# Altium schematic sheet EXP03_02_2104_20212241212.SchDoc
size A4 portrait
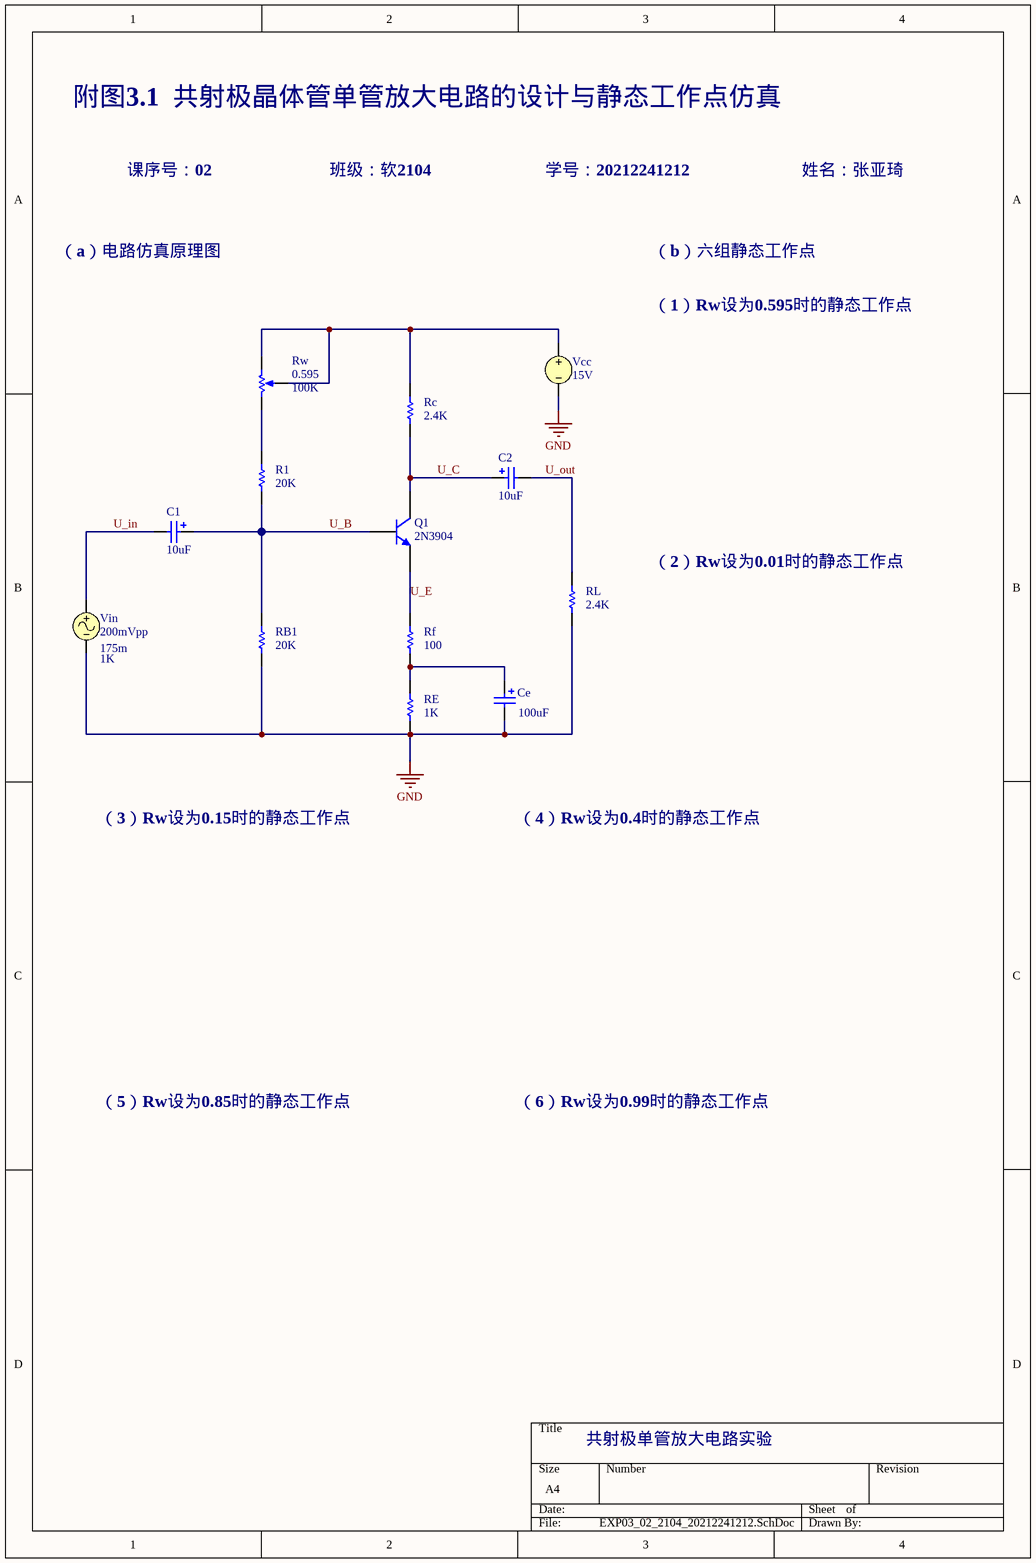
[diagram p0: EXP03_02_2104_20212241212.SchDoc]

## Parts
C1  10uF  [POLAR0.8]
C2  10uF  [POLAR0.8]
Ce  value 100uF  [POLAR0.8]  (hidden comment: Cap Pol2)
Q1  2N3904  [TO-92A]
R1  value 20K  [AXIAL-0.3]  (hidden comment: Res1)
RB1  value 20K  [AXIAL-0.3]  (hidden comment: Res1)
Rc  value 2.4K  [AXIAL-0.3]  (hidden comment: Res1)
RE  value 1K  [AXIAL-0.3]  (hidden comment: Res1)
Rf  value 100  [AXIAL-0.3]  (hidden comment: Res1)
RL  value 2.4K  [AXIAL-0.3]  (hidden comment: Res1)
Rw  value 100K  Set Position: 0.595  [VR5]  (hidden comment: RPot)
Vcc  15V
Vin  200mVpp  Amplitude: 175m  Frequency: 1K

## Nets
GND: Ce.2 RB1.1 RE.1 RL.1 Vcc.2 Vin.2
U_B: C1.1 Q1.2(B) R1.1 RB1.2
U_C: C2.1 Q1.3(C) Rc.1
U_E: Q1.1(E) Rf.2
U_in: C1.2 Vin.1
U_out: C2.2 RL.2
NetCe_1: Ce.1 RE.2 Rf.1
NetR1_2: R1.2 Rw.2(BOT)
NetRc_2: Rc.2 Rw.1(TOP) Rw.3(TAP) Vcc.1

## Notes on the sheet
- 附图3.1  共射极晶体管单管放大电路的设计与静态工作点仿真
- 课序号：02
- 班级：软2104
- 学号：20212241212
- 姓名：张亚琦
- （a）电路仿真原理图
- （b）六组静态工作点
- （1）Rw设为0.595时的静态工作点
- （2）Rw设为0.01时的静态工作点
- （3）Rw设为0.15时的静态工作点
- （4）Rw设为0.4时的静态工作点
- （5）Rw设为0.85时的静态工作点
- （6）Rw设为0.99时的静态工作点
- 共射极单管放大电路实验

## Library data of the parts
C1 C2 Ce = Cap Pol2: Polarized Capacitor (Axial); Published: 8-Jun-2000; LatestRevisionDate: 17-Jul-2002; LatestRevisionNote: Re-released for DXP Platform.; PackageReference: POLAR0.8; Publisher: Altium Limited
  C1 C2: Value: 10uF
Q1 = 2N3904: NPN General Purpose Amplifier; Published: 8-Jun-2000; LatestRevisionDate: 15-Jan-2003; LatestRevisionNote: PCB Footprint 'BCY-W3/D4.7' replaced; DatasheetDocument: 1997; PackageDocument: Sep-1998; PackageReference: TO-92A; Publisher: Altium Limited; Code_JEDEC: TO-92A; ComponentLink1Description: Manufacturer Link; ComponentLink1URL: http://www.fairchildsemi.com/; ComponentLink2Description: Datasheet; ComponentLink2URL: http://www.fairchildsemi.com/ds/2N%2F2N3904.pdf
R1 RB1 Rc RE Rf RL = Res1: Resistor; Published: 8-Jun-2000; LatestRevisionDate: 17-Jul-2002; LatestRevisionNote: Re-released for DXP Platform.; PackageReference: AXIAL-0.3; Publisher: Altium Limited
Rw = RPot: Potentiometer; Sim Note: Enter the Resistance value and the set point into parameter fields.; Published: 8-Jun-2000; LatestRevisionDate: 17-Jul-2002; LatestRevisionNote: Re-released for DXP Platform.; PackageReference: VR5; Publisher: Altium Limited
Vcc = VSRC: Voltage Source; Note: PCB Footprint - Not required; Published: 8-Jun-2000; LatestRevisionDate: 17-Jul-2002; LatestRevisionNote: Re-released for DXP Platform.; PackageReference: Not Applicable; Publisher: Altium Limited; Value: 15V
Vin = VSIN: Sinusoidal Voltage Source; Note: PCB Footprint - Not required; Published: 8-Jun-2000; LatestRevisionDate: 15-Nov-2004; LatestRevisionNote: Corrected Netlist.; PackageReference: Not Applicable; Publisher: Altium Limited